# Altium project 电流测试工装板.PrjPcb
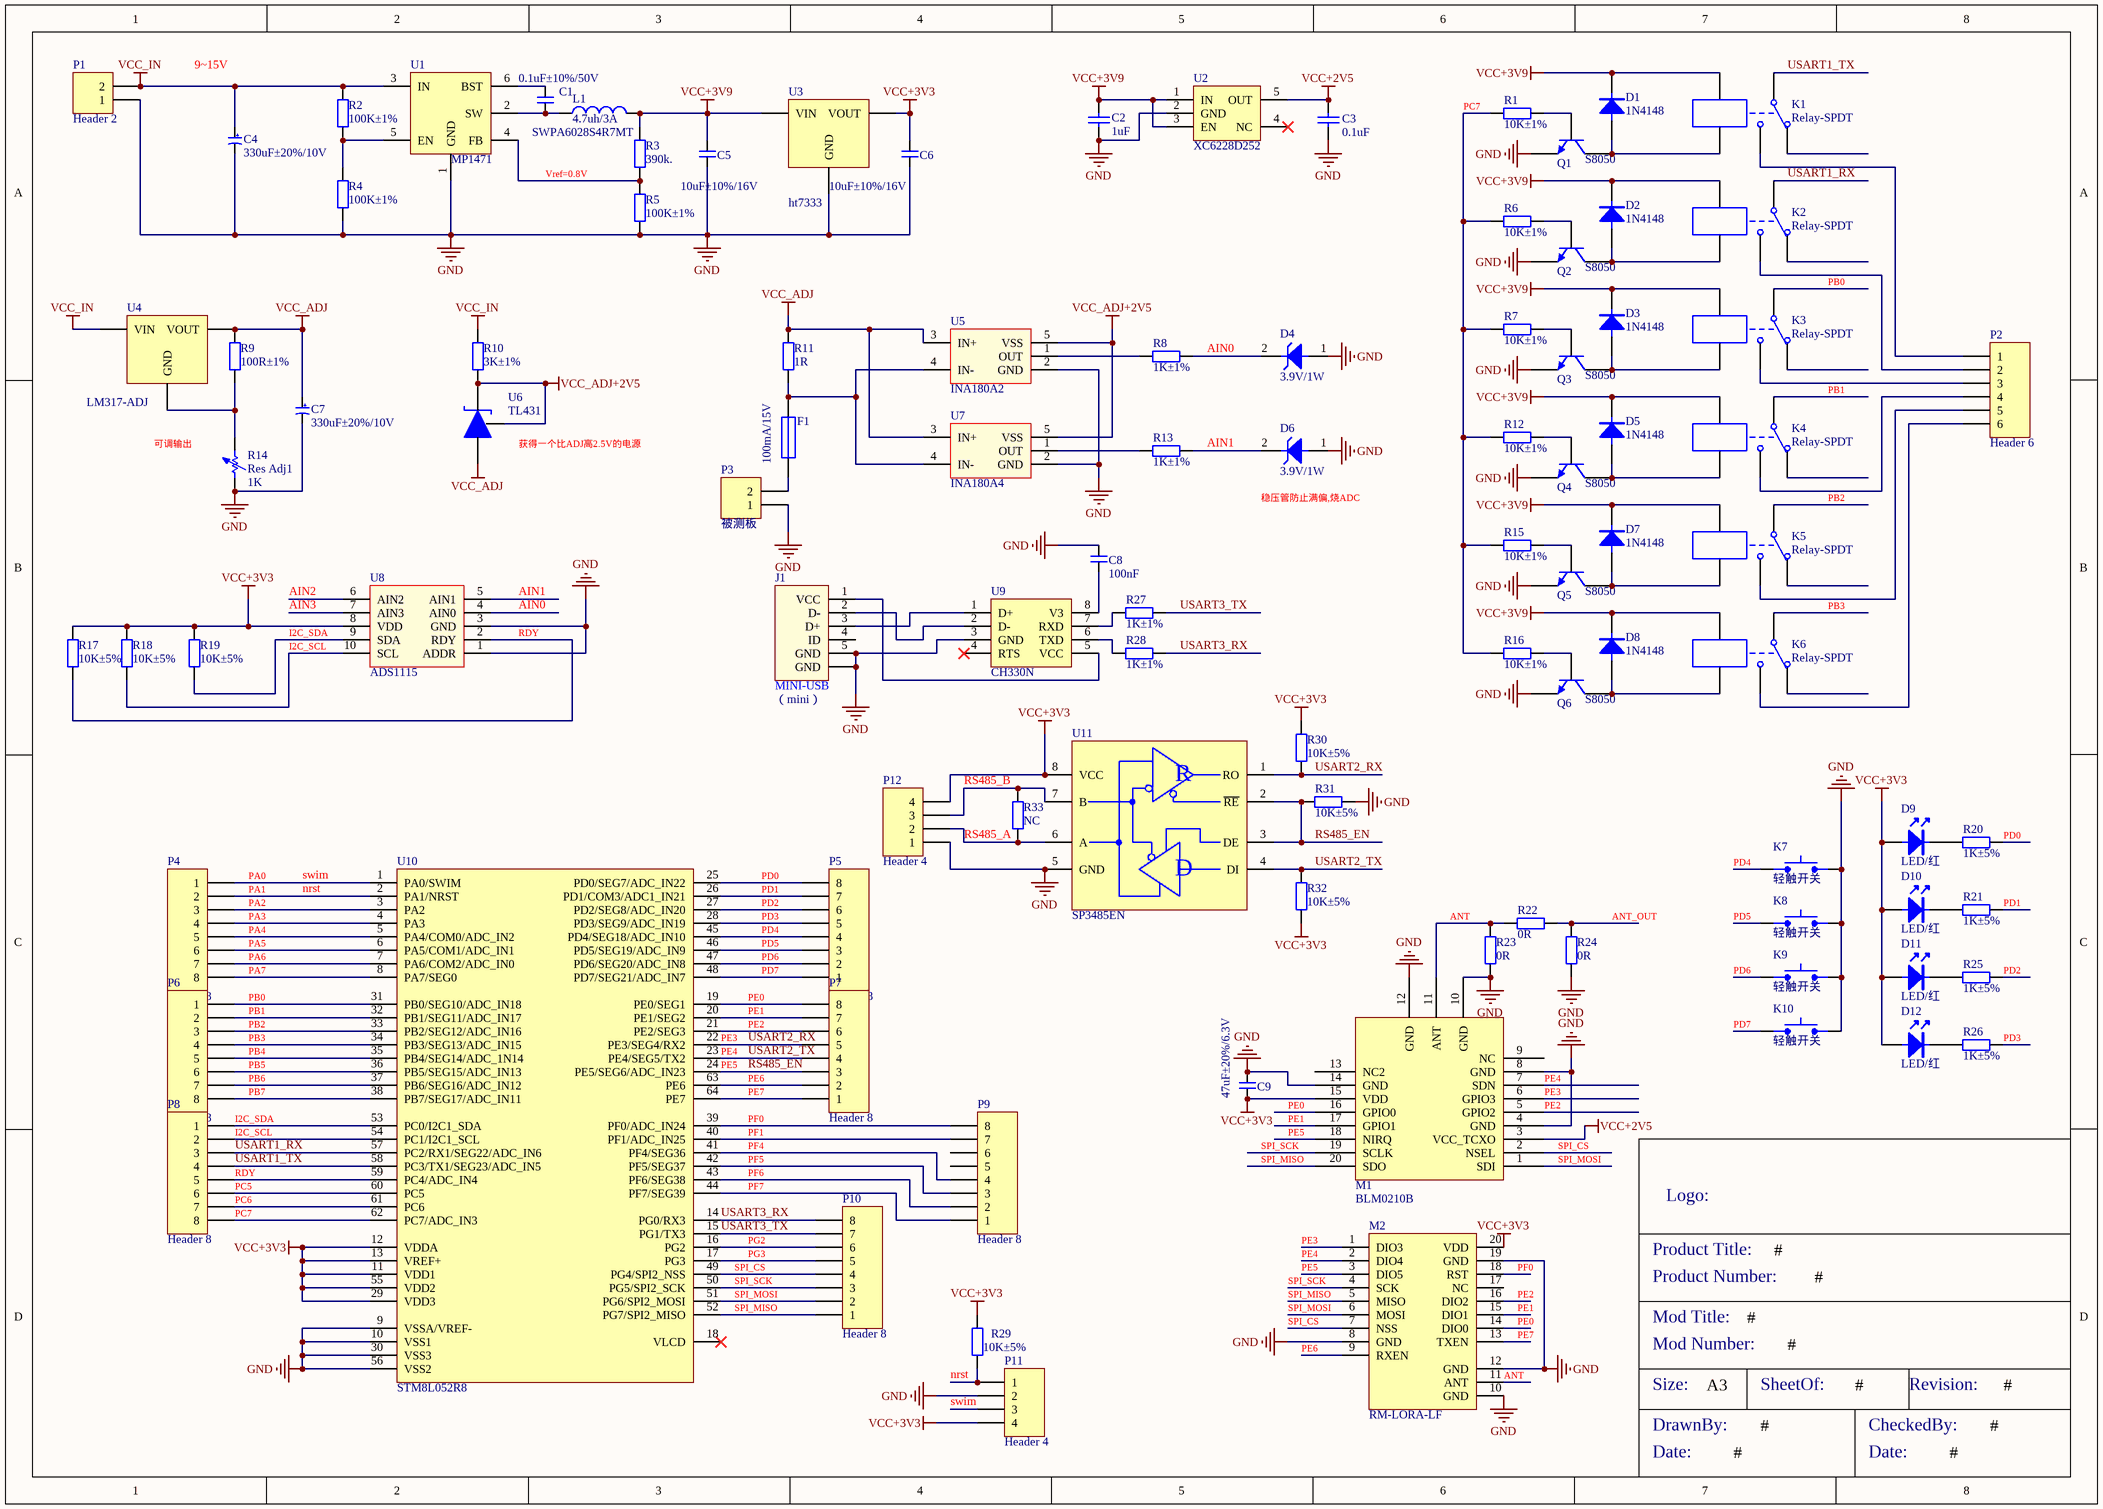
[diagram p0: 电流测试工装板.SchDoc]
1 sheet, 98 parts. Net scope: global (net labels, ports and power ports of the same name join across sheets).
Board file: 电流测试工装板.PcbDoc

## Sheet 电流测试工装板.SchDoc: #
size A3; Date: #; CheckedBy: #; CompanyName: 瑞臻信息（深圳）有限公司; DrawnBy: #; Address1: 深圳市南山区深南路万利达大厦2201室; Address2: 昆山市花桥镇花桥国际商务城绿地大道231弄9号楼杰座大厦2111室; Address3: 成都市高新区天府二街138号蜀都中心3号楼3110室; Address4: 浙江省宁波市余姚市冶山路475号1401室; Revision: #; SheetOf: #; ProductTitle: #; ProductNumber: #; ModuleTitle: #; ModuleNumber: #; : CheckedBy; CheckedByDate: #

### Parts
C1  0.1uF±10%/50V  [c0402]
C2  1uF  [C0402]
C3  0.1uF  [C0402]
C4  330uF±20%/10V  [CAP_2P_2R5_D6R3H11_W]
C5  10uF±10%/16V  [c0805]
C6  10uF±10%/16V  [c0805]
C7  330uF±20%/10V  [CAP_2P_2R5_D6R3H11_W]
C8  100nF  [c0402]
C9  47uF±20%/6.3V  [C1206]
D1  1N4148  [SOD123_2P_1R6X2R7]
D2  1N4148  [SOD123_2P_1R6X2R7]
D3  1N4148  [SOD123_2P_1R6X2R7]
D4  3.9V/1W  [LL41_2P_D2R5H5R0]
D5  1N4148  [SOD123_2P_1R6X2R7]
D6  3.9V/1W  [LL41_2P_D2R5H5R0]
D7  1N4148  [SOD123_2P_1R6X2R7]
D8  1N4148  [SOD123_2P_1R6X2R7]
D9  LED/红  [PZ_1X2P_2R54_Z]
D10  LED/红  [PZ_1X2P_2R54_Z]
D11  LED/红  [PZ_1X2P_2R54_Z]
D12  LED/红  [PZ_1X2P_2R54_Z]
F1  100mA/15V  [FUSE0603]
J1  （mini）  [DIP_MINI_USB-1]
K1  Relay-SPDT  [SRS-XXVDC-SL]
K2  Relay-SPDT  [SRS-XXVDC-SL]
K3  Relay-SPDT  [SRS-XXVDC-SL]
K4  Relay-SPDT  [SRS-XXVDC-SL]
K5  Relay-SPDT  [SRS-XXVDC-SL]
K6  Relay-SPDT  [SRS-XXVDC-SL]
K7  轻触开关  [PZ_1X2P_2R54_Z]
K8  轻触开关  [PZ_1X2P_2R54_Z]
K9  轻触开关  [PZ_1X2P_2R54_Z]
K10  轻触开关  [PZ_1X2P_2R54_Z]
L1  SWPA6028S4R7MT  value 4.7uh/3A  [SMD_INC_2P_6R0X6R0]
M1  BLM0210B  [FskMode_BL]
M2  RM-LORA-LF  [LORA_PIN_1]
P1  Header 2  [HDR1X2]
P2  Header 6  [HDR1X6]
P3  被测板  [HDR1X2]
P4  Header 8  [HDR1X8]
P5  Header 8  [HDR1X8]
P6  Header 8  [HDR1X8]
P7  Header 8  [HDR1X8]
P8  Header 8  [HDR1X8]
P9  Header 8  [HDR1X8]
P10  Header 8  [HDR1X8]
P11  Header 4  [HDR1X4]
P12  Header 4  [HDR1X4]
Q1  S8050  [SOT23_3P_0R95_1R3X2R9]
Q2  S8050  [SOT23_3P_0R95_1R3X2R9]
Q3  S8050  [SOT23_3P_0R95_1R3X2R9]
Q4  S8050  [SOT23_3P_0R95_1R3X2R9]
Q5  S8050  [SOT23_3P_0R95_1R3X2R9]
Q6  S8050  [SOT23_3P_0R95_1R3X2R9]
R1  10K±1%  [R0603]
R2  100K±1%  [R0402]
R3  390k.  [R0402]
R4  100K±1%  [R0402]
R5  100K±1%  [R0402]
R6  10K±1%  [R0603]
R7  10K±1%  [R0603]
R8  1K±1%  [R0603]
R9  100R±1%  [R0603]
R10  3K±1%  [R0603]
R11  1R  [R0603]
R12  10K±1%  [R0603]
R13  1K±1%  [R0603]
R14  Res Adj1  value 1K  [AXIAL-0.7]
R15  10K±1%  [R0603]
R16  10K±1%  [R0603]
R17  10K±5%  [R0402]
R18  10K±5%  [R0402]
R19  10K±5%  [R0402]
R20  1K±5%  [R0402]
R21  1K±5%  [R0402]
R22  0R  [R0603]
R23  0R  [R0603]
R24  0R  [R0603]
R25  1K±5%  [R0402]
R26  1K±5%  [R0402]
R27  1K±1%  [R0603]
R28  1K±1%  [R0603]
R29  10K±5%  [R0402]
R30  10K±5%  [R0402]
R31  10K±5%  [R0402]
R32  10K±5%  [R0402]
R33  NC  [R0402]
U1  MP1471  [TSOT23_6P_0R95_1R6X2R9]
U2  XC6228D252  [SOT23_5P_0R95_1R6X2R9]
U3  ht7333  [SOT89_3P_1R5_2R5X4R5]
U4  LM317-ADJ  [TO252_3P_2R3_6R2X6R7]
U5  INA180A2  [SOT23_5P_0R95_1R6X2R9]
U6  TL431  [SOT23_3P_0R95_1R3X2R9]
U7  INA180A4  [SOT23_5P_0R95_1R6X2R9]
U8  ADS1115  [MSOP_10P_3R0X5R0_P]
U9  CH330N  [SOP_8P_1R27_3R9X4R9]
U10  STM8L052R8  [LQFP_64P_0R5_10R0X10R0]
U11  SP3485EN  [SOP_8P_1R27_3R9X4R9]

### Nets
GND: C2.1 C3.1 C4.2 C5.1 C6.1 C7.2 C8.2 C9.2 D4.1(A) D6.1(A) J1.5(GND) J1.A(GND) K7.2 K8.2 K9.2 K10.2 M1.4(GND) M1.8(GND) M1.10(GND) M1.12(GND) M1.14(GND) M2.8(GND) M2.10(GND) M2.12(GND) M2.19(GND) P1.1 P3.1 P11.2 P12.1 Q1.2(E) Q2.2(E) Q3.2(E) Q4.2(E) Q5.2(E) Q6.2(E) R4.1 R5.1 R14.1 R23.1 R24.1 R31.1 U1.1(GND) U2.2(GND) U3.1(GND) U5.2(GND) U7.2(GND) U8.1(ADDR) U8.3(GND) U9.3(GND) U10.9(VSSA/VREF-) U10.10(VSS1) U10.30(VSS3) U10.56(VSS2) U11.5(GND)
VCC+2V5: C3.2 M1.3(VCC_TCXO) U2.5(OUT)
VCC+3V3: C6.2 C9.1 D9.1(A) D10.1(A) D11.1(A) D12.1(A) M1.15(VDD) M2.20(VDD) P11.4 P12.4 R17.2 R18.2 R19.2 R29.2 R30.2 R32.2 U3.3(VOUT) U8.8(VDD) U10.11(VDD1) U10.12(VDDA) U10.13(VREF+) U10.29(VDD3) U10.55(VDD2) U11.8(VCC)
VCC+3V9: C2.2 C5.2 D1.2(K) D2.2(K) D3.2(K) D5.2(K) D7.2(K) D8.2(K) K1.4 K2.4 K3.4 K4.4 K5.4 K6.4 L1.2 R3.2 U2.1(IN) U2.3(EN) U3.2(VIN)
VCC_ADJ: C7.1 R9.2 R11.2 U4.3(VOUT) U5.3(IN+) U6.3(A) U7.3(IN+)
VCC_ADJ+2V5: R10.1 U5.5(VSS) U6.1(K) U6.2(REF) U7.5(VSS)
VCC_IN: C4.1 P1.2 R2.2 R10.2 U1.3(IN) U4.2(VIN)
AIN0: D4.2(K) R8.2 U8.4(AIN0)
AIN1: D6.2(K) R13.2 U8.5(AIN1)
AIN2: U8.6(AIN2)
AIN3: U8.7(AIN3)
I2C_SCL: P8.2 R18.1 U8.10(SCL) U10.54(PC1/I2C1_SCL)
I2C_SDA: P8.1 R19.1 U8.9(SDA) U10.53(PC0/I2C1_SDA)
nrst: P4.2 P11.1 R29.1 U10.2(PA1/NRST)  [also labelled PA1]
PA0: P4.1 P11.3 U10.1(PA0/SWIM)  [also labelled swim]
PA2: P4.3 U10.3(PA2)
PA3: P4.4 U10.4(PA3)
PA4: P4.5 U10.5(PA4/COM0/ADC_IN2)
PA5: P4.6 U10.6(PA5/COM1/ADC_IN1)
PA6: P4.7 U10.7(PA6/COM2/ADC_IN0)
PA7: P4.8 U10.8(PA7/SEG0)
PB0: K3.1 P6.1 U10.31(PB0/SEG10/ADC_IN18)
PB1: K4.1 P6.2 U10.32(PB1/SEG11/ADC_IN17)
PB2: K5.1 P6.3 U10.33(PB2/SEG12/ADC_IN16)
PB3: K6.1 P6.4 U10.34(PB3/SEG13/ADC_IN15)
PB4: P6.5 U10.35(PB4/SEG14/ADC_1N14)
PB5: P6.6 U10.36(PB5/SEG15/ADC_IN13)
PB6: P6.7 U10.37(PB6/SEG16/ADC_IN12)
PB7: P6.8 U10.38(PB7/SEG17/ADC_IN11)
PC5: P8.6 U10.60(PC5)
PC6: P8.7 U10.61(PC6)
PC7: P8.8 R1.1 R6.1 R7.1 R12.1 R15.1 R16.1 U10.62(PC7/ADC_IN3)
PD0: P5.8 R20.2 U10.25(PD0/SEG7/ADC_IN22)
PD1: P5.7 R21.2 U10.26(PD1/COM3/ADC1_IN21)
PD2: P5.6 R25.2 U10.27(PD2/SEG8/ADC_IN20)
PD3: P5.5 R26.2 U10.28(PD3/SEG9/ADC_IN19)
PD4: P5.4 U10.45(PD4/SEG18/ADC_IN10)
PD5: P5.3 U10.46(PD5/SEG19/ADC_IN9)
PD6: P5.2 U10.47(PD6/SEG20/ADC_IN8)
PD7: P5.1 U10.48(PD7/SEG21/ADC_IN7)
PE0: M1.16(GPIO0) M2.14(DIO0) P7.8 U10.19(PE0/SEG1)
PE1: M1.17(GPIO1) M2.15(DIO1) P7.7 U10.20(PE1/SEG2)
PE2: M1.5(GPIO2) M2.16(DIO2) P7.6 U10.21(PE2/SEG3)
PE3: M1.6(GPIO3) M2.1(DIO3) P7.5 R30.1 U10.22(PE3/SEG4/RX2) U11.1(RO)  [also labelled USART2_RX]
PE4: M1.7(SDN) M2.2(DIO4) P7.4 R32.1 U10.23(PE4/SEG5/TX2) U11.4(DI)  [also labelled USART2_TX]
PE5: M1.18(NIRQ) M2.3(DIO5) P7.3 R31.2 U10.24(PE5/SEG6/ADC_IN23) U11.2(~{RE}) U11.3(DE)  [also labelled RS485_EN]
PE6: M2.9(RXEN) P7.2 U10.63(PE6)
PE7: M2.13(TXEN) P7.1 U10.64(PE7)
PF0: M2.18(RST) P9.8 U10.39(PF0/ADC_IN24)
PF1: P9.7 U10.40(PF1/ADC_IN25)
PF4: P9.4 U10.41(PF4/SEG36)
PF5: P9.3 U10.42(PF5/SEG37)
PF6: P9.2 U10.43(PF6/SEG38)
PF7: P9.1 U10.44(PF7/SEG39)
PG2: P10.6 U10.16(PG2)
PG3: P10.5 U10.17(PG3)
RDY: P8.5 R17.1 U8.2(RDY) U10.59(PC4/ADC_IN4)
RS485_A: P12.2 R33.2 U11.6(A)
RS485_B: P12.3 R33.1 U11.7(B)
SPI_CS: M1.2(NSEL) M2.7(NSS) P10.4 U10.49(PG4/SPI2_NSS)
SPI_MISO: M1.20(SDO) M2.5(MISO) P10.1 U10.52(PG7/SPI2_MISO)
SPI_MOSI: M1.1(SDI) M2.6(MOSI) P10.2 U10.51(PG6/SPI2_MOSI)
SPI_SCK: M1.19(SCLK) M2.4(SCK) P10.3 U10.50(PG5/SPI2_SCK)
USART1_RX: K2.1 P8.3 U10.57(PC2/RX1/SEG22/ADC_IN6)
USART1_TX: K1.1 P8.4 U10.58(PC3/TX1/SEG23/ADC_IN5)
USART3_RX: P10.8 R28.2 U10.14(PG0/RX3)
USART3_TX: P10.7 R27.2 U10.15(PG1/TX3)
NetC1_1: C1.1 L1.1 U1.2(SW)
NetC1_2: C1.2 U1.6(BST)
NetC8_1: C8.1 U9.8(V3)
NetD1_1: D1.1(A) K1.5 Q1.3(C)
NetD2_1: D2.1(A) K2.5 Q2.3(C)
NetD3_1: D3.1(A) K3.5 Q3.3(C)
NetD5_1: D5.1(A) K4.5 Q4.3(C)
NetD7_1: D7.1(A) K5.5 Q5.3(C)
NetD8_1: D8.1(A) K6.5 Q6.3(C)
NetD9_2: D9.2(K) R20.1
NetD10_2: D10.2(K) R21.1
NetD11_2: D11.2(K) R25.1
NetD12_2: D12.2(K) R26.1
NetF1_1: F1.1 P3.2
NetF1_2: F1.2 R11.1 U5.4(IN-) U7.4(IN-)
NetJ1_1: J1.1(VCC) U9.5(VCC)
NetJ1_2: J1.2(D-) U9.2(D-)
NetJ1_3: J1.3(D+) U9.1(D+)
NetK1_3: K1.3 P2.1
NetK2_3: K2.3 P2.2
NetK3_3: K3.3 P2.3
NetK4_3: K4.3 P2.4
NetK5_3: K5.3 P2.5
NetK6_3: K6.3 P2.6
NetM1_11: M1.11(ANT) R22.1 R23.2
NetQ1_1: Q1.1(B) R1.2
NetQ2_1: Q2.1(B) R6.2
NetQ3_1: Q3.1(B) R7.2
NetQ4_1: Q4.1(B) R12.2
NetQ5_1: Q5.1(B) R15.2
NetQ6_1: Q6.1(B) R16.2
NetR2_1: R2.1 R4.2 U1.5(EN)
NetR3_1: R3.1 R5.2 U1.4(FB)
NetR8_1: R8.1 U5.1(OUT)
NetR9_1: R9.1 R14.2 U4.1(GND)
NetR13_1: R13.1 U7.1(OUT)
NetR22_2: R22.2 R24.2
NetR27_1: R27.1 U9.7(RXD)
NetR28_1: R28.1 U9.6(TXD)

Not connected (* = marked no-connect by the designer): J1 4(ID); K1 2; K2 2; K3 2; K4 2; K5 2; K6 2; K7 1; K8 1; K9 1; K10 1; M1 9(NC) 13(NC2); M2 11(ANT) 17(NC); P9 5 6; U2 4(NC)*; U9 4(RTS)*; U10 18(VLCD)*

### Notes on the sheet
- 9~15V
- Vref=0.8V
- 可调输出
- (near U6) 获得一个比ADJ高2.5V的电源
- (near D6) 稳压管防止满偏,烧ADC
- (near R23) ANT
- ANT_OUT
- (near K7) PD4
- (near K8) PD5
- (near K9) PD6
- (near K10) PD7
- (near M2) ANT
- Product Title:
- Logo:
- Product Number:
- Mod Title:
- Size:
- Mod Number:
- A3
- SheetOf:
- Revision:
- DrawnBy:
- Date:
- CheckedBy:
- (in symbol 1.2.18.09.0173) R; D
- (in symbol USB座子-2（mini）) MINI-USB

### Library data of the parts
C1 = 1.2.04.05.0169: 瓷片电容-0.1uF-±10%-16V-X5R-0402; Supplier Manufacturer: 未知; Old P/N: 00011; D/S: S; Edit Note: V1.0-创建-20161230-徐永伟; Grade: A; Part Number: 1.2.04.05.0169; Part Type: MLCC; Value: 0.1uF±10%/50V; ComponentLink1URL: z:\altiumdesigner\规格书\02原材料\04电容\05瓷片电容\; Supplier: 供应商; height: XX; Model: 未知; Unit Price: ￥0.001; Footprint: 0402; ComponentLink1Description: 规格书; Component Type: standy; ComponentLink2Description: ROHS报告; ComponentLink2URL: z:\altiumdesigner\规格书\02原材料\04电容\05瓷片电容\; Pin Count: 2; Published: V1.0; Publisher: 徐永伟
C2 = Cap: Capacitor,Ceramic,0603-16V-X5R-104-K-YAGEO; Manufacturer: YAGEO; Value: 0.1uF; Ordering code: CC0603KRX5R7BB104; Published: 8-Jun-2000; LatestRevisionDate: 17-Jul-2002; LatestRevisionNote: Re-released for DXP Platform.; PackageReference: RAD-0.3; Publisher: Altium Limited
C3 = Cap: Capacitor,Ceramic,0603-16V-X5R-104-K-YAGEO; Manufacturer: YAGEO; Ordering code: CC0603KRX5R7BB104; Published: 8-Jun-2000; LatestRevisionDate: 17-Jul-2002; LatestRevisionNote: Re-released for DXP Platform.; PackageReference: RAD-0.3; Publisher: Altium Limited; Value: 0.1uF
C4 C7 = 1.2.04.03.0001: 电解电容_330uF±20%/10V_0.2R_-40~105℃_4000Hours_D6R3H11; 厂家: 常州华威; 器件高度: 11mm; D/S: D; Edit Note: V1.0-创建-20190329-徐永伟; 物料等级: 试产; Part Number: 1.2.04.03.0001; Part Type: 电解电容; Value: 330uF±20%/10V; ComponentLink1URL: z:\规格书\02原材料\04电容\03铝电解电容\常州超威电解电容RT系列.pdf; Unit Price: ￥0.001; Footprint: DIP; ComponentLink1Description: 规格书; Component Type: standy; Pin Count: 2; Published: V1.0; Publisher: 徐永伟
C5 C6 = 1.2.04.05.0201: 瓷片电容-10uF-±10%-16V-X5R-0805; Supplier Manufacturer: 未知; Old P/N: 00106; D/S: S; Edit Note: V1.0-创建-20161230-徐永伟; Grade: A; Part Number: 1.2.04.05.0201; Part Type: MLCC; Value: 10uF±10%/16V; ComponentLink1URL: z:\altiumdesigner\规格书\02原材料\04电容\05瓷片电容\; Supplier: 供应商; height: XX; Model: 未知; Unit Price: ￥0.001; Footprint: 0805; ComponentLink1Description: 规格书; Component Type: standy; ComponentLink2Description: ROHS报告; ComponentLink2URL: z:\altiumdesigner\规格书\02原材料\04电容\05瓷片电容\; Pin Count: 2; Published: V1.0; Publisher: 徐永伟
C8 = 1.2.04.05.0001: MLCC_47uF±20%_6.3V_X5R_H1.6mm_1206; Value: 20pF; 厂家: 三星; 器件高度: 1.6mm; 厂家型号: CL31A476MQHNNNE; D/S: S; Edit Note: V1.0-创建-20180711-徐永伟; 器件状态: 试产; Part Number: 1.2.04.05.0001; Part Type: MLCC; ComponentLink1URL: z:\规格书\02原材料\04电容\05瓷片电容\SAMS-S-A0000377162-1.pdf; Unit Price: ￥0.001; Footprint: 1206; ComponentLink1Description: 规格书; Component Type: standy; Pin Count: 2; Published: V1.0; Publisher: 徐永伟
C9 = 1.2.04.05.0001: MLCC_47uF±20%_6.3V_X5R_H1.6mm_1206; 厂家: 三星; 器件高度: 1.6mm; 厂家型号: CL31A476MQHNNNE; D/S: S; Edit Note: V1.0-创建-20180711-徐永伟; 物料等级: 试产; Part Number: 1.2.04.05.0001; Part Type: MLCC; Value: 47uF±20%/6.3V; ComponentLink1URL: z:\规格书\02原材料\04电容\05瓷片电容\SAMS-S-A0000377162-1.pdf; Unit Price: ￥0.001; ComponentLink1Description: 规格书; Component Type: standy; Pin Count: 2; Published: V1.0; Publisher: 徐永伟
D1-D3 D5 D7 D8 = 1.2.08.01.0002: 开关二极管_1N4148_0.3A/100V_Vf=0.5V_SOD123; 单价: ￥0.001; D/S: S; Edit Note: V1.0-创建-20190815-徐永伟; 物料等级: 量产; Part Number: 1.2.08.01.0002; Part Type: 开关二极管; Value: 1N4148; ComponentLink1URL: Z:\规格书\02原材料\08晶体管\01二极管\1N4148SOD123.PDF; 厂家型号: 1N4148; Footprint: SOD123; ComponentLink1Description: 规格书; Component Type: standy; Pin Count: 2; Published: V1.0; Publisher: 徐永伟
D4 D6 = 1.2.08.04.0001: 稳压二极管_ZM4730A_3.9V/1W_LL41; 单价: ￥0.001; D/S: S; Edit Note: V1.0-创建-20190815-徐永伟; 物料等级: 量产; Part Number: 1.2.08.04.0001; Part Type: 稳压二极管; Value: 3.9V/1W; ComponentLink1URL: Z:\规格书\02原材料\08晶体管\04稳压二极管\ZM4730A.pdf; 代理商: 代理商; 厂家型号: ZM4730A; Footprint: LL41; ComponentLink1Description: 规格书; Component Type: standy; Pin Count: 2; Published: V1.0; Publisher: 徐永伟
D9-D12 = 1.2.08.02.0002: 发光二极管_红色_Vf=2.3V_0603; 单价: ￥0.001; D/S: S; Edit Note: V1.0-创建-20190815-徐永伟; 物料等级: 量产; Part Number: 1.2.08.02.0002; Part Type: LED; Value: LED/红; ComponentLink1URL: Z:\规格书\02原材料\08晶体管\02发光二极管\E6C0603URAC1UDA(630nm).pdf; 代理商: 代理商; Footprint: 0603; ComponentLink1Description: 规格书; Component Type: standy; Pin Count: 2; Published: V1.0; Publisher: 徐永伟
F1 = 1.2.13.03.0001: 自恢复保险丝_0.05A/15V_100A_0.5W_0.5A/1.5s_0603; Model: ASMD0603-010; D/S: S; Edit Note: V1.0-创建-20190816-徐永伟; 物料等级: 研发; Part Number: 1.2.13.03.0001; Part Type: 自恢复保险丝; Value: 100mA/15V; ComponentLink1URL: Z:\规格书\02原材料\13保护器件\03自恢复保险丝\0.05APTC.PDF; height: 1.0mm; Unit Price: ￥0.001; Footprint: 0603; ComponentLink1Description: 规格书; Component Type: standy; Pin Count: 2; Published: V1.0; Publisher: 徐永伟
J1 = USB座子-2（mini）
K1-K6 = Relay-SPDT: Single-Pole Dual-Throw Relay; Published: 24-Mar-1999; LatestRevisionDate: 17-Jul-2002; LatestRevisionNote: Re-released for DXP Platform.; PackageReference: MODULE5B; Publisher: Altium Limited
K7-K10 = 1.2.15.01.0001: 轻触开关_12Vdc/50mA_0.25mm_250gf_3.6X6.1X2.5mm_表贴SMD; D/S: S; Edit Note: V1.0-创建-20190825-徐永伟; 物料等级: 量产; Part Number: 1.2.15.01.0001; Part Type: 贴片轻触开关; Value: 轻触开关; ComponentLink1URL: Z:\规格书\02原材料\15机械开关\01轻触按钮开关\C118141.pdf; height: 2.5mm; Unit Price: ￥0.001; Footprint: 3.5X6.0; ComponentLink1Description: 规格书; Component Type: standy; Pin Count: 2; Published: V1.0; Publisher: 徐永伟
L1 = Inductor
M1 = 1.1.01.38.0002: SI4463模块，不带LNA; 厂家: 苏州博联; 器件高度: 待定; D/S: S; Edit Note: V1.0-创建-20180709-徐永伟; 物料等级: 研发; Part Number: 1.1.01.38.0002; Part Type: RF模块; Value: BLM0210B; ComponentLink1URL: Z:\规格书\02原材料\21电路模块\04无线模块\4463模块资料.rar; 厂家型号: BLM0210B; Unit Price: ￥0.001; Footprint: SMT; ComponentLink1Description: 资料包; Component Type: standy; Pin Count: 20; Published: V1.0; Publisher: 徐永伟
M2 = 1.1.01.38.0003: LORA模块_RM-LORA-PCB11-V2.21_430M~490M_Pout=17dBm_SMD20; 厂家: 瑞臻信息; 器件高度: 待定; D/S: S; Edit Note: V1.0-创建-20180709-徐永伟; 物料等级: 量产; Part Number: 1.1.01.38.0003; Part Type: RF模块; Value: RM-LORA-LF; ComponentLink1URL: Z:\规格书\02原材料\21电路模块\04无线模块\; 厂家型号: RM-LORA-PCB11-V2.21; Unit Price: ￥0.001; Footprint: SMT; ComponentLink1Description: 资料包; Component Type: standy; Pin Count: 20; Published: V1.0; Publisher: 徐永伟
P1 P3 = Header 2: Header, 2-Pin; LatestRevisionDate: 17-Jul-2002; LatestRevisionNote: Re-released for DXP Platform.; Publisher: Altium Limited
P2 = Header 6: Header, 6-Pin; LatestRevisionDate: 17-Jul-2002; LatestRevisionNote: Re-released for DXP Platform.; Publisher: Altium Limited
P4-P10 = Header 8: Header, 8-Pin; LatestRevisionDate: 17-Jul-2002; LatestRevisionNote: Re-released for DXP Platform.; Publisher: Altium Limited
P11 P12 = Header 4: Header, 4-Pin; LatestRevisionDate: 17-Jul-2002; LatestRevisionNote: Re-released for DXP Platform.; Publisher: Altium Limited
Q1-Q6 = 1.2.08.08.0002: 三极管	_NPN_S8050_Vceo=25V_Ic=0.5A_β>50_SOT23; 单价: ￥0.001; D/S: S; Edit Note: V1.0-创建-20190815-徐永伟; 物料等级: 量产; Part Number: 1.2.08.08.0002; Part Type: 三极管; Value: S8050; ComponentLink1URL: Z:\规格书\02原材料\08晶体管\08三极管\S8050_SOT23.pdf; 代理商: 代理商; 厂家型号: S8050; Footprint: SOT23; ComponentLink1Description: 规格书; Component Type: standy; Pin Count: 3; Published: V1.0; Publisher: 徐永伟
R1 R6 R7 R12 R15 R16 = 1.2.03.01.0009: 电阻_10K±1%_1/10W_0603; 厂家: 旺诠; 器件高度: 0.5mm; 厂家型号: RTT031002FTP; 单价: ￥0.001; D/S: S; 焊点: 2; 版本: V1.0; 创建者: 徐永伟; 编辑记录: V1.0-创建-20190329-徐永伟; 物料等级: 量产; Part Number: 1.2.03.01.0009; Part Type: 贴片电阻; Value: 10K±1%; ComponentLink1URL: z:\规格书\02原材料\03电阻\01普通电阻\旺诠电阻.pdf; 供应商: 供应商; 封装: R0603; ComponentLink1Description: 规格书; ComponentLink2Description: ROHS报告; ComponentLink5Description: 代理资质; ComponentLink3Description: 可靠性测试报告; ComponentLink4Description: 性能检测报告
R2 R4 R5 = 1.2.03.01.XXX1: 贴片电阻，1K±5%，1/16W，50V，0402; Supplier Manufacturer: Hottchohm; Old P/N: 00528; Value: 22K±1%; D/S: S; Edit Note: V1.0-创建-20160831-徐永伟; Part Number: 1.2.03.01.XXX1; Part Type: 普通电阻; Supplier: 供应商; height: 0.5mm; Unit Price: ￥0.001; Footprint: 0402; ComponentLink1Description: 规格书; Component Type: standy; Pin Count: 2; Published: V1.0; Publisher: 徐永伟
R3 = 1.2.03.01.0019: 电阻_510R±1%_1/16W_0402; Value: 510K±1%; 厂家: 厚声; 器件高度: 0.5mm; 厂家型号: 0402WGF5103TCE; 单价: ￥0.001; D/S: S; 焊点: 2; 版本: V1.0; 创建者: 徐永伟; 编辑记录: V1.0-创建-20190329-徐永伟; 物料等级: 量产; Part Number: 1.2.03.01.0019; Part Type: 贴片电阻; ComponentLink1URL: z:\规格书\02原材料\03电阻\01普通电阻\厚声电阻.pdf; 供应商: 供应商; 封装: R0402; ComponentLink1Description: 规格书; ComponentLink2Description: ROHS报告; ComponentLink5Description: 代理资质; ComponentLink3Description: 可靠性测试报告; ComponentLink4Description: 性能检测报告
R8 R13 R27 R28 = 1.2.03.01.0006: 电阻_1K±1%_1/10W_0603; 厂家: 旺诠; 器件高度: 0.5mm; 厂家型号: RTT031001FTP; 单价: ￥0.001; D/S: S; 焊点: 2; 版本: V1.0; 创建者: 徐永伟; 编辑记录: V1.0-创建-20190329-徐永伟; 物料等级: 量产; Part Number: 1.2.03.01.0006; Part Type: 贴片电阻; Value: 1K±1%; ComponentLink1URL: z:\规格书\02原材料\03电阻\01普通电阻\旺诠电阻.pdf; 供应商: 供应商; 封装: R0603; ComponentLink1Description: 规格书; ComponentLink2Description: ROHS报告; ComponentLink5Description: 代理资质; ComponentLink3Description: 可靠性测试报告; ComponentLink4Description: 性能检测报告
R9 = 1.2.03.01.0017: 电阻_100R±1%_1/10W_0603; 厂家: 华科; 器件高度: 0.5mm; 厂家型号: WR06X1000FTL; 单价: ￥0.001; D/S: S; 焊点: 2; 版本: V1.0; 创建者: 徐永伟; 编辑记录: V1.0-创建-20190329-徐永伟; 物料等级: 量产; Part Number: 1.2.03.01.0017; Part Type: 贴片电阻; Value: 100R±1%; ComponentLink1URL: z:\规格书\02原材料\03电阻\01普通电阻\华科电阻.pdf; 供应商: 供应商; 封装: R0603; ComponentLink1Description: 规格书; ComponentLink2Description: ROHS报告; ComponentLink5Description: 代理资质; ComponentLink3Description: 可靠性测试报告; ComponentLink4Description: 性能检测报告
R10 = 1.2.03.01.0027: 电阻_3K±1%_1/10W_0603; 厂家: 国巨; 器件高度: 0.5mm; 厂家型号: RC0603FR-073KL; 单价: ￥0.001; D/S: S; 焊点: 2; 版本: V1.0; 创建者: 徐永伟; 编辑记录: V1.0-创建-20190329-徐永伟; 物料等级: 量产; Part Number: 1.2.03.01.0027; Part Type: 贴片电阻; Value: 3K±1%; ComponentLink1URL: z:\规格书\02原材料\03电阻\01普通电阻\国巨电阻.pdf; 供应商: 供应商; 封装: R0603; ComponentLink1Description: 规格书; ComponentLink2Description: ROHS报告; ComponentLink5Description: 代理资质; ComponentLink3Description: 可靠性测试报告; ComponentLink4Description: 性能检测报告
R11 = 1.2.03.01.0027: 电阻_3K±1%_1/10W_0603; Value: 3K±1%; 厂家: 国巨; 器件高度: 0.5mm; 厂家型号: RC0603FR-073KL; 单价: ￥0.001; D/S: S; 焊点: 2; 版本: V1.0; 创建者: 徐永伟; 编辑记录: V1.0-创建-20190329-徐永伟; 物料等级: 量产; Part Number: 1.2.03.01.0027; Part Type: 贴片电阻; ComponentLink1URL: z:\规格书\02原材料\03电阻\01普通电阻\国巨电阻.pdf; 供应商: 供应商; 封装: R0603; ComponentLink1Description: 规格书; ComponentLink2Description: ROHS报告; ComponentLink5Description: 代理资质; ComponentLink3Description: 可靠性测试报告; ComponentLink4Description: 性能检测报告
R14 = Res Adj1: Variable Resistor; Set Position: 0.5; Published: 8-Jun-2000; LatestRevisionDate: 17-Jul-2002; LatestRevisionNote: Re-released for DXP Platform.; PackageReference: AXIAL-0.7; Publisher: Altium Limited; PackageDescription: Axial Device, Thru-Hole; 2 Leads; 0.7 in Pin Spacing
R17-R19 R29-R32 = 1.2.03.01.0012: 电阻_10K±5%_1/16W_0402; 厂家: 旺诠; 器件高度: 0.5mm; 厂家型号: RTT02103JTH; 单价: ￥0.001; D/S: S; 焊点: 2; 版本: V1.0; 创建者: 徐永伟; 编辑记录: V1.0-创建-20190329-徐永伟; 物料等级: 量产; Part Number: 1.2.03.01.0012; Part Type: 贴片电阻; Value: 10K±5%; ComponentLink1URL: z:\规格书\02原材料\03电阻\01普通电阻\旺诠电阻.pdf; 供应商: 供应商; 封装: R0402; ComponentLink1Description: 规格书; ComponentLink2Description: ROHS报告; ComponentLink5Description: 代理资质; ComponentLink3Description: 可靠性测试报告; ComponentLink4Description: 性能检测报告
R20 R21 R25 R26 = 1.2.03.01.0014: 电阻_1K±5%_1/16W_0402; 厂家: 旺诠; 器件高度: 0.5mm; 厂家型号: RTT02102JTH; 单价: ￥0.001; D/S: S; 焊点: 2; 版本: V1.0; 创建者: 徐永伟; 编辑记录: V1.0-创建-20190329-徐永伟; 物料等级: 量产; Part Number: 1.2.03.01.0014; Part Type: 贴片电阻; Value: 1K±5%; ComponentLink1URL: z:\规格书\02原材料\03电阻\01普通电阻\旺诠电阻.pdf; 供应商: 供应商; 封装: R0402; ComponentLink1Description: 规格书; ComponentLink2Description: ROHS报告; ComponentLink5Description: 代理资质; ComponentLink3Description: 可靠性测试报告; ComponentLink4Description: 性能检测报告
R22-R24 = 1.2.03.01.0009: 电阻_10K±1%_1/10W_0603; Value: 10K±1%; 厂家: 旺诠; 器件高度: 0.5mm; 厂家型号: RTT031002FTP; 单价: ￥0.001; D/S: S; 焊点: 2; 版本: V1.0; 创建者: 徐永伟; 编辑记录: V1.0-创建-20190329-徐永伟; 物料等级: 量产; Part Number: 1.2.03.01.0009; Part Type: 贴片电阻; ComponentLink1URL: z:\规格书\02原材料\03电阻\01普通电阻\旺诠电阻.pdf; 供应商: 供应商; 封装: R0603; ComponentLink1Description: 规格书; ComponentLink2Description: ROHS报告; ComponentLink5Description: 代理资质; ComponentLink3Description: 可靠性测试报告; ComponentLink4Description: 性能检测报告
R33 = 1.2.03.01.0012: 电阻_10K±5%_1/16W_0402; Value: 10K±5%; 厂家: 旺诠; 器件高度: 0.5mm; 厂家型号: RTT02103JTH; 单价: ￥0.001; D/S: S; 焊点: 2; 版本: V1.0; 创建者: 徐永伟; 编辑记录: V1.0-创建-20190329-徐永伟; 物料等级: 量产; Part Number: 1.2.03.01.0012; Part Type: 贴片电阻; ComponentLink1URL: z:\规格书\02原材料\03电阻\01普通电阻\旺诠电阻.pdf; 供应商: 供应商; 封装: R0402; ComponentLink1Description: 规格书; ComponentLink2Description: ROHS报告; ComponentLink5Description: 代理资质; ComponentLink3Description: 可靠性测试报告; ComponentLink4Description: 性能检测报告
U2 = 1.2.18.07.0003: XC6228D252_LDO稳压_500mA/2.5V_Vmax=7V_SOT23-5; 厂家: TOREX; 器件高度: 1.35mm; 厂家型号: XC6228D252VR; 单价: ￥0.001; D/S: S; Edit Note: V1.0-创建-20180709-徐永伟; 物料状态: 量产; Part Number: 1.2.18.07.0003; Part Type: LDO; Value: XC6228D252; ComponentLink1URL: Z:\规格书\02原材料\18集成电路\17线性稳压器\XC6228-2.5V.pdf; Footprint: SOT23-5; ComponentLink1Description: 规格书; Component Type: standy; Pin Count: 5; Published: V1.0; Publisher: 徐永伟
U3 = 1.2.18.07.0002: HT7333_LDO稳压_250mA/3.3V_Vmax=12V_SOT89; 厂家: HOLTEK; 器件高度: 1.6mm; 单价: ￥0.001; D/S: S; Edit Note: V1.0-创建-20180709-徐永伟; 物料等级: 量产; Part Number: 1.2.18.07.0002; Part Type: LDO; Value: ht7333; ComponentLink1URL: Z:\规格书\02原材料\18集成电路\17线性稳压器\HT7318.pdf; 厂家型号: HT7333; Footprint: SOT89; ComponentLink1Description: 规格书; Component Type: standy; Pin Count: 3; Published: V1.0; Publisher: 徐永伟
U4 = 1.2.18.07.0002: HT7333_LDO稳压_250mA/3.3V_Vmax=12V_SOT89; Value: ht7333; 厂家: HOLTEK; 器件高度: 1.6mm; 单价: ￥0.001; D/S: S; Edit Note: V1.0-创建-20180709-徐永伟; 物料等级: 量产; Part Number: 1.2.18.07.0002; Part Type: LDO; ComponentLink1URL: Z:\规格书\02原材料\18集成电路\17线性稳压器\HT7318.pdf; 厂家型号: HT7333; Footprint: SOT89; ComponentLink1Description: 规格书; Component Type: standy; Pin Count: 3; Published: V1.0; Publisher: 徐永伟
U5 U7 = INA180A
U6 = TL431A
U10 = 1.2.18.01.0001: MCU_STM8L052R8_Vin=1.8~3.6V_16MHz_Flash/64Kb_RAM/4Kb_8位_E2PROM/256B_LCD8X24_-40~85℃_LQFP64; 厂家: ST; 器件高度: 1.6mm; 厂家型号: STM8L052R8T6; 单价: ￥0.001; D/S: S; Edit Note: V1.0-创建-20170105-徐永伟; 物料等级: 量产; Part Number: 1.2.18.01.0001; Part Type: MCU; Value: STM8L052R8; ComponentLink1URL: Z:\规格书\02原材料\18集成电路\01通用处理器\STM8L052R8.pdf; Footprint: LQFP64; ComponentLink1Description: 规格书; Component Type: standy; ComponentLink2Description: 用户手册; ComponentLink2URL: Z:\规格书\02原材料\18集成电路\01通用处理器\STM8L参考手册.pdf; Pin Count: 64; Published: V1.0; Publisher: 徐永伟
U11 = 1.2.18.09.0173: RS485收发器-SP3485EN-支持485收发-SOP8; Supplier Manufacturer: Sipex; Old P/N: 00289; D/S: S; Edit Note: V1.0-创建-20170122-徐永伟; Grade: A; Part Number: 1.2.18.09.0173; ComponentLink1URL: Z:\AltiumDesigner\规格书\02原材料\18集成电路\09接口芯片\SP3485EN.pdf; ComponentLink1Description: 规格书; ComponentLink2Description: ROHS报告; Part Type: 接口IC; Value: SP3485EN; height: 1.7mm; Model: SP3485EN; Unit Price: ￥0.001; Footprint: SOP8; Component Type: standy; Pin Count: 8; Published: V1.0; Publisher: 徐永伟